# EAGLE schematic deepak_sch_Newest (EAGLE 7.5.0)
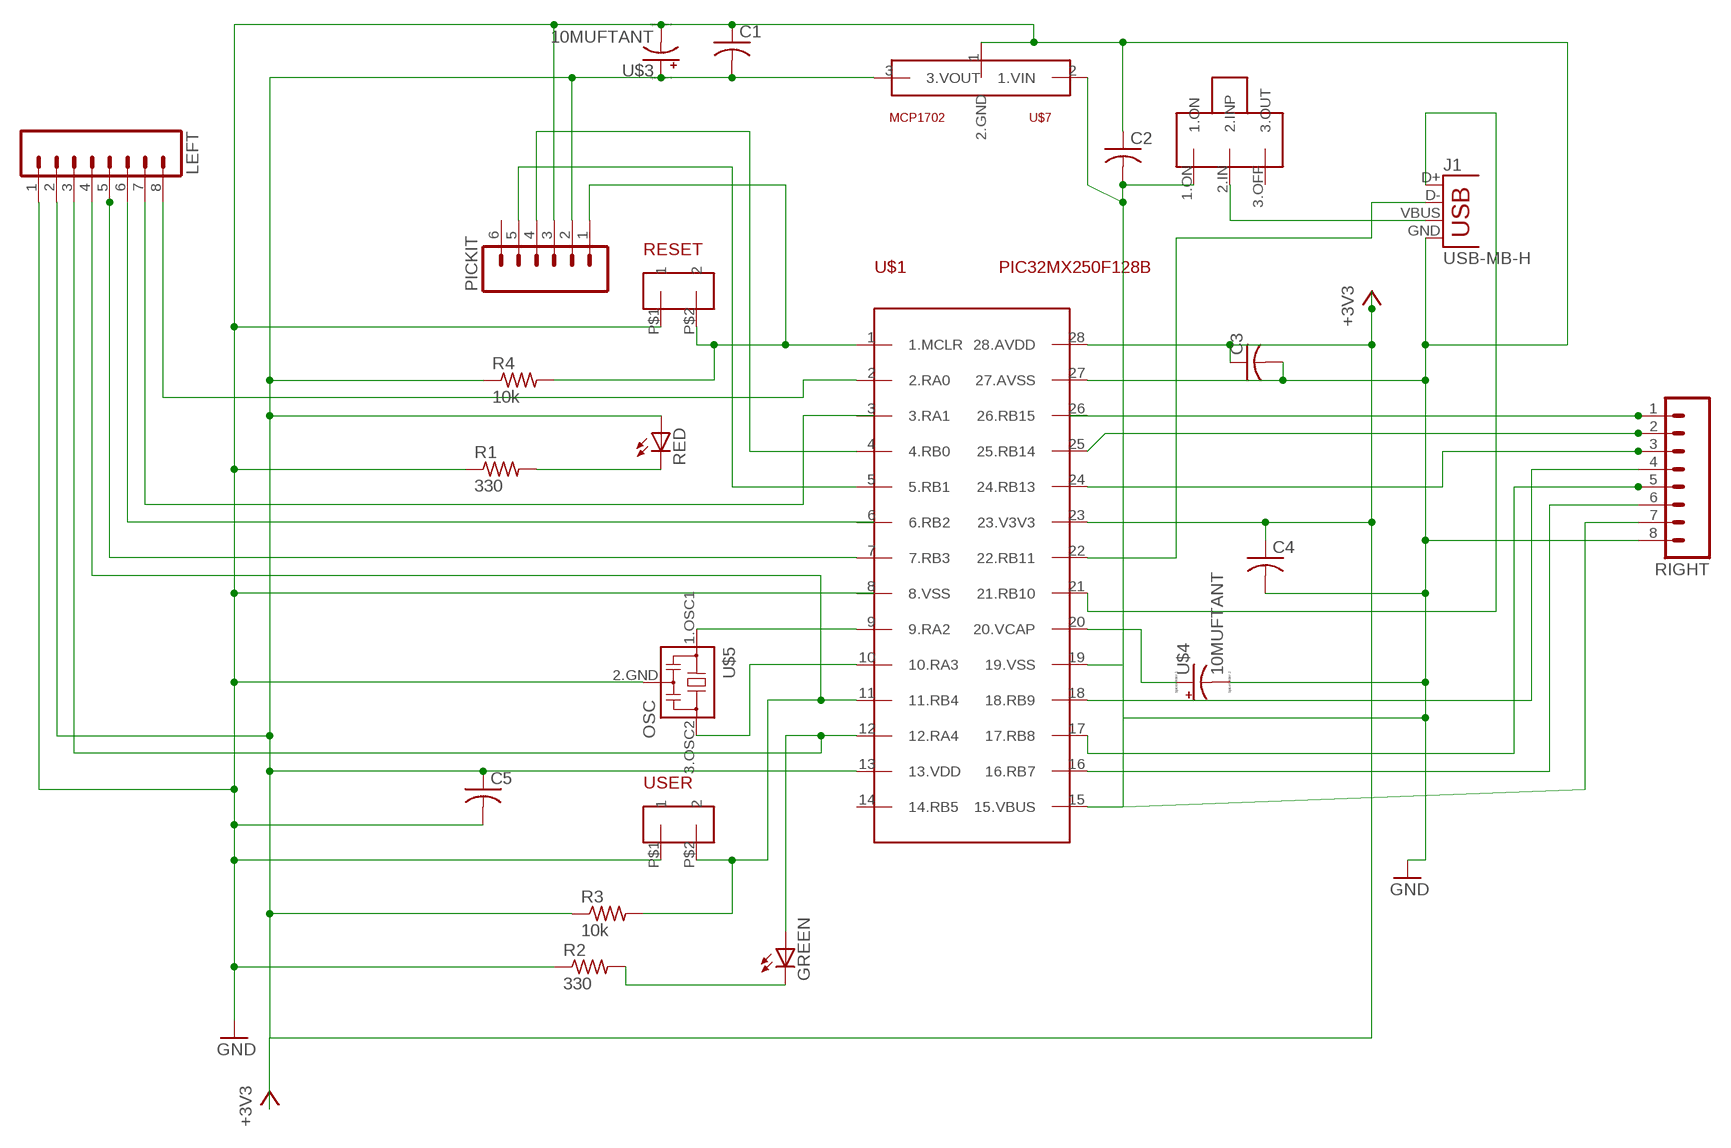
[diagram p0: schematic, sheet 1]

## Parts
C1  C-US025-025X050  [C025-025X050]
C2  C-US025-025X050  [C025-025X050]
C3  C-US025-025X050  [C025-025X050]
C4  C-US025-025X050  [C025-025X050]
C5  C-US025-025X050  [C025-025X050]
GREEN  LED3MM  [LED3MM]
J1  USB-MB-H  [USB-MB-H]
LEFT  M08  [1X08_ROUND]
PICKIT  M06SILK_FEMALE_PTH  [1X06]
R1  330  R-US_0207/10  [0207/10]
R2  330  R-US_0207/10  [0207/10]
R3  10k  R-US_0207/10  [0207/10]
R4  10k  R-US_0207/10  [0207/10]
RED  LED3MM  [LED3MM]
RESET  PUSHBTN  [PUSHBTN]
RIGHT  M08  [1X08_ROUND]
U$1  PIC32MX250F128B  [DIL28-3]
U$2  SLIDESWITCH  [SLIDESWITCH]
U$3  10MUFTANT  [10MUFTANT]
U$4  10MUFTANT  [10MUFTANT]
U$5  OSC  [OSC]
U$7  MCP1702  [TO92]
USER  PUSHBTN  [PUSHBTN]

## Nets
+3V3: C1.2 C3.1 C4.1 C5.1 LEFT.2 PICKIT.2 R3.1 R4.1 RED.A U$1.13(13.VDD) U$1.23(23.V3V3) U$1.28(28.AVDD) U$3.1.PLUS(+) U$7.3(3.VOUT)
GND: C1.1 C2.1 C3.2 C4.2 C5.2 J1.GND LEFT.1 PICKIT.3 R1.1 R2.1 RESET.P$1 RIGHT.8 U$1.19(19.VSS) U$1.27(27.AVSS) U$3.2.MINUS(-) U$4.2.MINUS(-) U$5.2.GND U$7.1(2.GND) USER.P$1
N$1: J1.VBUS U$2.2.IN(2.INP)
N$2: C2.2 RIGHT.7 U$1.15(15.VBUS) U$2.1.ON U$7.2(1.VIN)
N$3: GREEN.A LEFT.3 U$1.12(12.RA4)
N$4: PICKIT.4 U$1.4(4.RB0)
N$5: PICKIT.5 U$1.5(5.RB1)
N$6: U$1.9(9.RA2) U$5.1.OSC1
N$7: U$1.10(10.RA3) U$5.3.OSC2
N$8: LEFT.4 R3.2 U$1.11(11.RB4) USER.P$2
N$9: PICKIT.1 R4.2 RESET.P$2 U$1.1(1.MCLR)
N$10: GREEN.K(C) R2.2
N$11: J1.D- U$1.22(22.RB11)
N$12: J1.D+ U$1.21(21.RB10)
N$13: LEFT.5 U$1.7(7.RB3)
N$14: U$1.20(20.VCAP) U$4.1.PLUS(+)
N$15: R1.2 RED.K(C)
N$16: RIGHT.1
N$17: LEFT.8 U$1.2(2.RA0)
N$18: LEFT.7
N$19: LEFT.6
N$20: RIGHT.2 U$1.25(25.RB14)
N$21: RIGHT.3 U$1.24(24.RB13)
N$22: RIGHT.4 U$1.18(18.RB9)
N$23: RIGHT.5 U$1.17(17.RB8)
N$24: RIGHT.6 U$1.16(16.RB7)
Unconnected: PICKIT.6 U$1.3(3.RA1) U$1.6(6.RB2) U$1.8(8.VSS) U$1.14(14.RB5) U$1.26(26.RB15) U$2.3.OFF(3.OUT)

## Library data of the parts
C1-C5 = ME433_2:C-US: CAPACITOR, American symbol
GREEN RED = ME433_2:LED: LED OSRAM: - CHIPLED LG R971, LG N971, LY N971, LG Q971, LY Q971, LO R971, LY R971 LH N974, LH R974 LS Q976, LO Q976, LY Q976 LO Q996 - Hyper CHIPLED LW Q18S LB Q993, LB Q99A, LB R99A - SideLED LS A670, LO A670, LY A670, LG A670, LP A670 LB A673, LV A673, LT A673, LW A673 LH A674 LY A675 LS A676, LA A676, LO A676, LY A676, LW A676 LS A679, LY A679, LG A679 - Hyper Micro SIDELED® LS Y876, LA Y876, LO Y876, LY Y876 LT Y87S - SmartLED LW L88C, LW L88S LB L89C, LB L89S, LG L890 LS L89K, LO L89K, LY L89K LS L896, LA L896, LO L896, LY L896 - TOPLED LS T670, LO T670, LY T670, LG T670, LP T670 LSG T670, LSP T670, LSY T670, LOP T670, LYG T670 LG T671, LOG T671, LSG T671 LB T673, LV T673, LT T673, LW T673 LH T674 LS T676, LA T676, LO T676, LY T676, LB T676, LH T676, LSB T676, LW T676 LB T67C, LV T67C, LT T67C, LS T67K, LO T67K, LY T67K, LW E67C LS E67B, LA E67B, LO E67B, LY E67B, LB E67C, LV E67C, LT E67C LW T67C LS T679, LY T679, LG T679 LS T770, LO T770, LY T770, LG T770, LP T770 LB T773, LV T773, LT T773, LW T773 LH T774 LS E675, LA E675, LY E675, LS T675 LS T776, LA T776, LO T776, LY T776, LB T776 LHGB T686 LT T68C, LB T68C - Hyper Mini TOPLED® LB M676 - Mini TOPLED Santana® LG M470 LS M47K, LO M47K, LY M47K Source: http://www.osram.convergy.de LUXEON: - LUMILED® LXK2-PW12-R00, LXK2-PW12-S00, LXK2-PW14-U00, LXK2-PW14-V00 LXK2-PM12-R00, LXK2-PM12-S00, LXK2-PM14-U00 LXK2-PE12-Q00, LXK2-PE12-R00, LXK2-PE12-S00, LXK2-PE14-T00, LXK2-PE14-U00 LXK2-PB12-K00, LXK2-PB12-L00, LXK2-PB12-M00, LXK2-PB14-N00, LXK2-PB14-P00, LXK2-PB14-Q00 LXK2-PR12-L00, LXK2-PR12-M00, LXK2-PR14-Q00, LXK2-PR14-R00 LXK2-PD12-Q00, LXK2-PD12-R00, LXK2-PD12-S00 LXK2-PH12-R00, LXK2-PH12-S00 LXK2-PL12-P00, LXK2-PL12-Q00, LXK2-PL12-R00 Source: www.luxeon.com KINGBRIGHT: KA-3528ASYC Source: www.kingbright.com
J1 = ME433_2:USB: USB Connectors USB-B-PTH is fully proven SKU : PRT-00139/CONN-08278 USB-miniB is fully proven SKU : PRT-00587 USB-A-PCB is untested. USB-A-H is throughly reviewed, but untested. Spark Fun Electronics SKU : PRT-00437 USB-B-SMT is throughly reviewed, but untested. Needs silkscreen touching up. USB-A-S has not been used/tested USB-MB-H has not been used/tested USB-MICROB has been used. CONN-09505
LEFT RIGHT = ME433_2:M08: Header 8 Standard 8-pin 0.1" header. Use with straight break away headers (SKU : PRT-00116), right angle break away headers (PRT-00553), swiss pins (PRT-00743), machine pins (PRT-00117), and female headers (PRT-00115).; PROD_ID: CONN-08437
PICKIT = ME433_2:M06: Header 6 Standard 6-pin 0.1" header. Use with straight break away headers (SKU : PRT-00116), right angle break away headers (PRT-00553), swiss pins (PRT-00743), machine pins (PRT-00117), and female headers (PRT-00115). Molex polarized connector foot print use with SKU : PRT-08094 with associated crimp pins and housings. NOTES ON THE VARIANTS LOCK and LOCK_LONGPADS... This footprint was designed to help hold the alignment of a through-hole component (i.e. 6-pin header) while soldering it into place. You may notice that each hole has been shifted either up or down by 0.005 of an inch from it's more standard position (which is a perfectly straight line). This slight alteration caused the pins (the squares in the middle) to touch the edges of the holes. Because they are alternating, it causes a "brace" to hold the component in place. 0.005 has proven to be the perfect amount of "off-center" position when using our standard breakaway headers. Although looks a little odd when you look at the bare footprint, once you have a header in there, the alteration is very hard to notice. Also,if you push a header all the way into place, it is covered up entirely on the bottom side. This idea of altering the position of holes to aid alignment will be further integrated into the Sparkfun Library for other footprints. It can help hold any component with 3 or more connection pins.; PROD_ID: CONN-08437
R1-R4 = ME433_2:R-US_: RESISTOR, American symbol
RESET USER = ME433_2:PUSHBTN
U$1 = ME433_2:PIC32MX250F128B
U$2 = ME433_2:SLIDESWITCH
U$3 U$4 = ME433_2:10MUFTANT
U$5 = ME433_2:OSC
U$7 = ME433_2:MCP1702